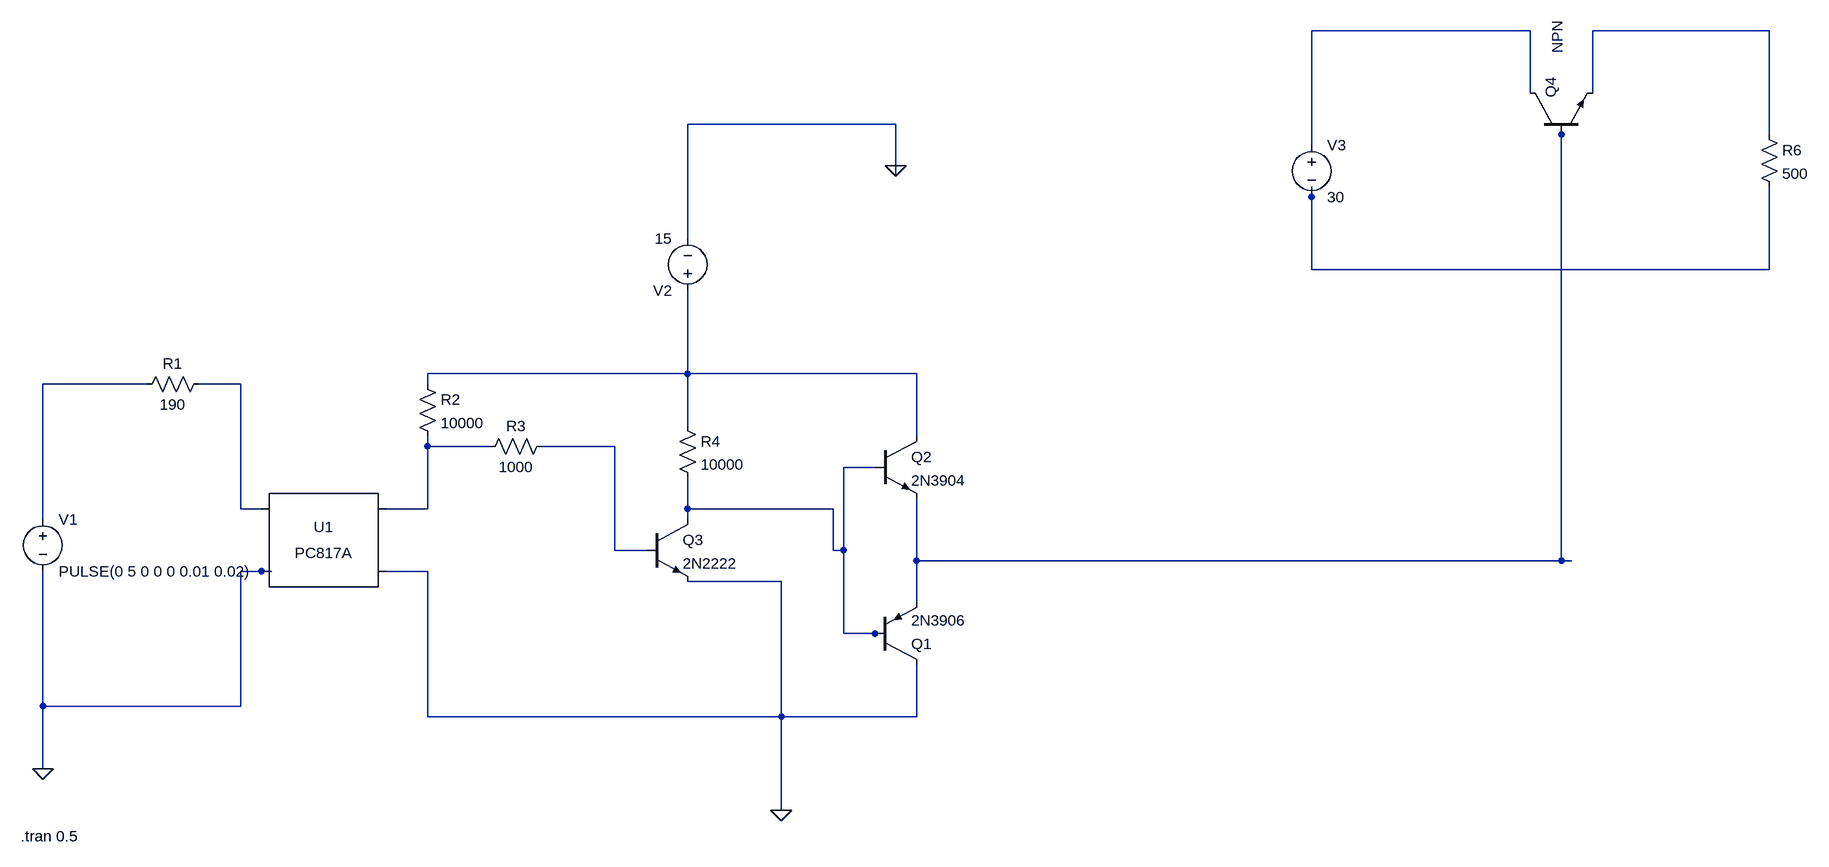
[diagram p0: schematic Saini.asc]
Saini.asc, the LTspice schematic file:
Version 4
SHEET 1 2360 680
WIRE 1760 -1856 1424 -1856
WIRE 2128 -1856 1856 -1856
WIRE 1760 -1760 1760 -1856
WIRE 1856 -1760 1856 -1856
WIRE 784 -1712 464 -1712
WIRE 1808 -1696 1808 -1712
WIRE 2128 -1696 2128 -1856
WIRE 1424 -1680 1424 -1856
WIRE 784 -1648 784 -1712
WIRE 784 -1632 784 -1648
WIRE 1424 -1600 1424 -1616
WIRE 464 -1536 464 -1712
WIRE 1424 -1488 1424 -1600
WIRE 2128 -1488 2128 -1616
WIRE 2128 -1488 1424 -1488
WIRE 464 -1328 464 -1456
WIRE 464 -1328 64 -1328
WIRE 816 -1328 464 -1328
WIRE -368 -1312 -528 -1312
WIRE -224 -1312 -288 -1312
WIRE 64 -1312 64 -1328
WIRE 464 -1248 464 -1328
WIRE 816 -1232 816 -1328
WIRE 64 -1216 64 -1232
WIRE 160 -1216 64 -1216
WIRE 352 -1216 240 -1216
WIRE 752 -1184 704 -1184
WIRE -224 -1120 -224 -1312
WIRE -192 -1120 -224 -1120
WIRE 64 -1120 64 -1216
WIRE 64 -1120 0 -1120
WIRE 464 -1120 464 -1168
WIRE 688 -1120 464 -1120
WIRE -528 -1104 -528 -1312
WIRE 464 -1104 464 -1120
WIRE 352 -1056 352 -1216
WIRE 400 -1056 352 -1056
WIRE 688 -1056 688 -1120
WIRE 704 -1056 704 -1184
WIRE 704 -1056 688 -1056
WIRE 816 -1040 816 -1136
WIRE 1808 -1040 1808 -1696
WIRE 1808 -1040 816 -1040
WIRE 1824 -1040 1808 -1040
WIRE -192 -1024 -224 -1024
WIRE -176 -1024 -192 -1024
WIRE 64 -1024 0 -1024
WIRE 608 -1008 464 -1008
WIRE 816 -976 816 -1040
WIRE 704 -928 704 -1056
WIRE 752 -928 704 -928
WIRE 768 -928 752 -928
WIRE -528 -816 -528 -1024
WIRE -224 -816 -224 -1024
WIRE -224 -816 -528 -816
WIRE 64 -800 64 -1024
WIRE 608 -800 608 -1008
WIRE 608 -800 64 -800
WIRE 816 -800 816 -880
WIRE 816 -800 608 -800
WIRE -528 -720 -528 -816
WIRE 608 -656 608 -800
FLAG 608 -656 0
FLAG 784 -1648 0
FLAG -528 -720 0
SYMBOL Optos\\PC817A -96 -1072 R0
SYMATTR InstName U1
SYMBOL voltage -528 -1120 R0
WINDOW 123 24 44 Left 2
WINDOW 39 0 0 Left 0
SYMATTR InstName V1
SYMATTR Value PULSE(0 5 0 0 0 0.01 0.02)
SYMBOL res -272 -1328 R90
WINDOW 0 0 56 VBottom 2
WINDOW 3 32 56 VTop 2
SYMATTR InstName R1
SYMATTR Value 190
SYMBOL res 48 -1328 R0
SYMATTR InstName R2
SYMATTR Value 10000
SYMBOL res 256 -1232 R90
WINDOW 0 0 56 VBottom 2
WINDOW 3 32 56 VTop 2
SYMATTR InstName R3
SYMATTR Value 1000
SYMBOL npn 752 -1232 R0
SYMATTR InstName Q2
SYMATTR Value 2N3904
SYMBOL npn 400 -1104 R0
SYMATTR InstName Q3
SYMATTR Value 2N2222
SYMBOL res 448 -1264 R0
SYMATTR InstName R4
SYMATTR Value 10000
SYMBOL pnp 752 -880 M180
SYMATTR InstName Q1
SYMATTR Value 2N3906
SYMBOL voltage 464 -1440 R180
WINDOW 123 0 0 Left 0
WINDOW 39 0 0 Left 0
SYMATTR InstName V2
SYMATTR Value 15
SYMBOL voltage 1424 -1696 R0
WINDOW 123 0 0 Left 0
WINDOW 39 0 0 Left 0
SYMATTR InstName V3
SYMATTR Value 30
SYMBOL npn 1760 -1696 R270
WINDOW 3 125 42 Left 2
SYMATTR InstName Q4
SYMBOL res 2112 -1712 R0
SYMATTR InstName R6
SYMATTR Value 500
TEXT -562 -616 Left 2 !.tran 0.5

The netlist it stands for:
* Saini.asc
XU1 N007 0 N008 0 PC817 Igain=1m
V1 N006 0 PULSE(0 5 0 0 0 0.01 0.02)
R1 N007 N006 190
R2 N005 N008 10000
R3 N009 N008 1000
Q2 N005 N010 N003 0 2N3904
Q3 N010 N009 0 0 2N2222
R4 N005 N010 10000
Q1 0 N010 N003 0 2N3906
V2 N005 0 15
V3 N001 N004 30
Q4 N001 N003 N002 0 NPN
R6 N002 N004 500
.model NPN NPN
.model PNP PNP
.lib standard.bjt
.tran 0.5
.lib PC817.sub
.backanno
.end